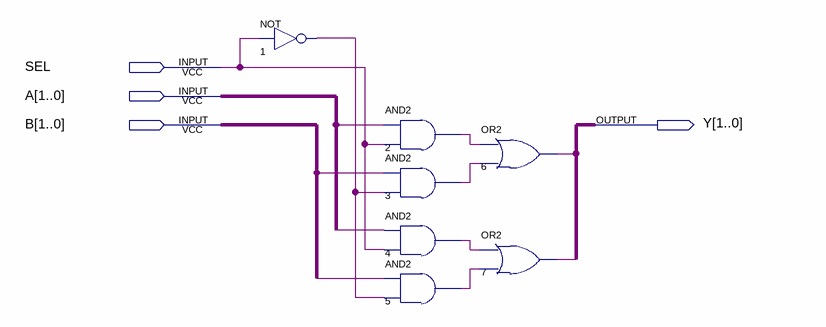
[diagram p0: schematic sheet]
// Quartus schematic multiplexador_2.bdf as structural Verilog: 7 symbols, 4 pins
module multiplexador_2 (
  input  SEL,
  input  [1:0] A,
  input  [1:0] B,
  output [1:0] Y
);

  wire n1_out, n2_out, n3_out, n4_out, n5_out;

  not u_1 (n1_out, SEL);
  and u_2 (n2_out, A[0], SEL);
  and u_3 (n3_out, B[0], n1_out);
  and u_4 (n4_out, A[1], SEL);
  and u_5 (n5_out, B[1], n1_out);
  or u_6 (Y[0], n2_out, n3_out);
  or u_7 (Y[1], n4_out, n5_out);
endmodule
